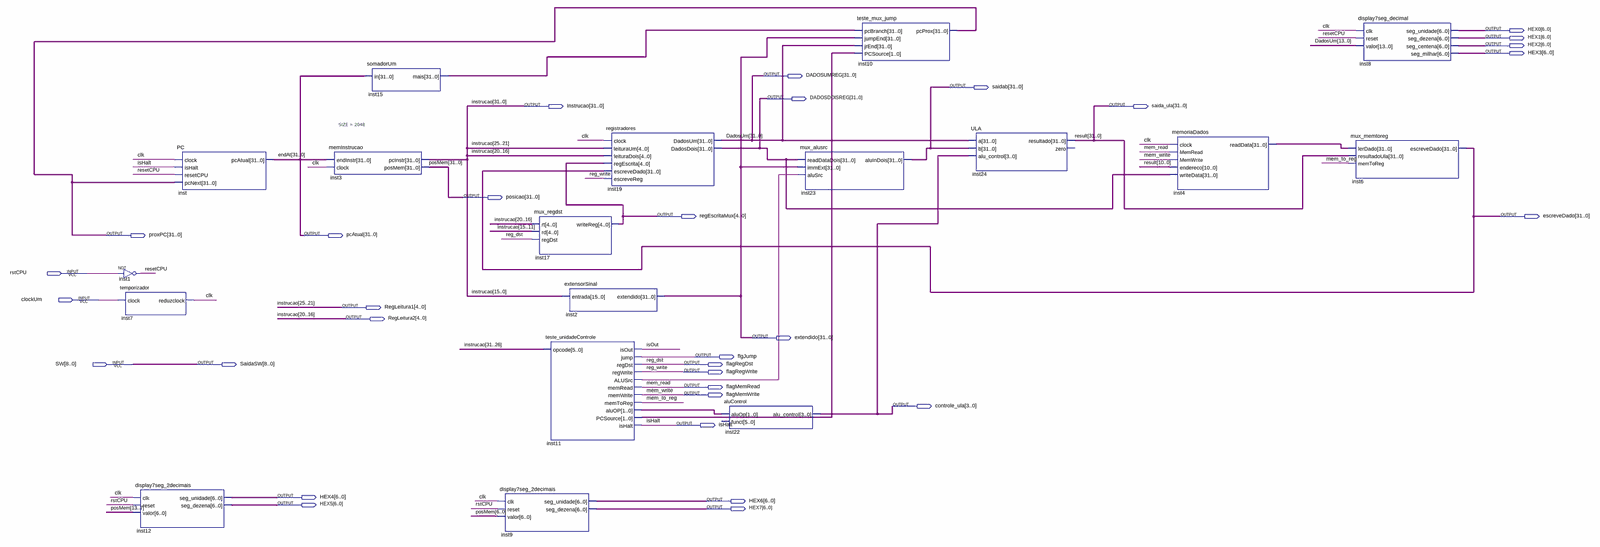
[diagram p0: schematic sheet, whole]
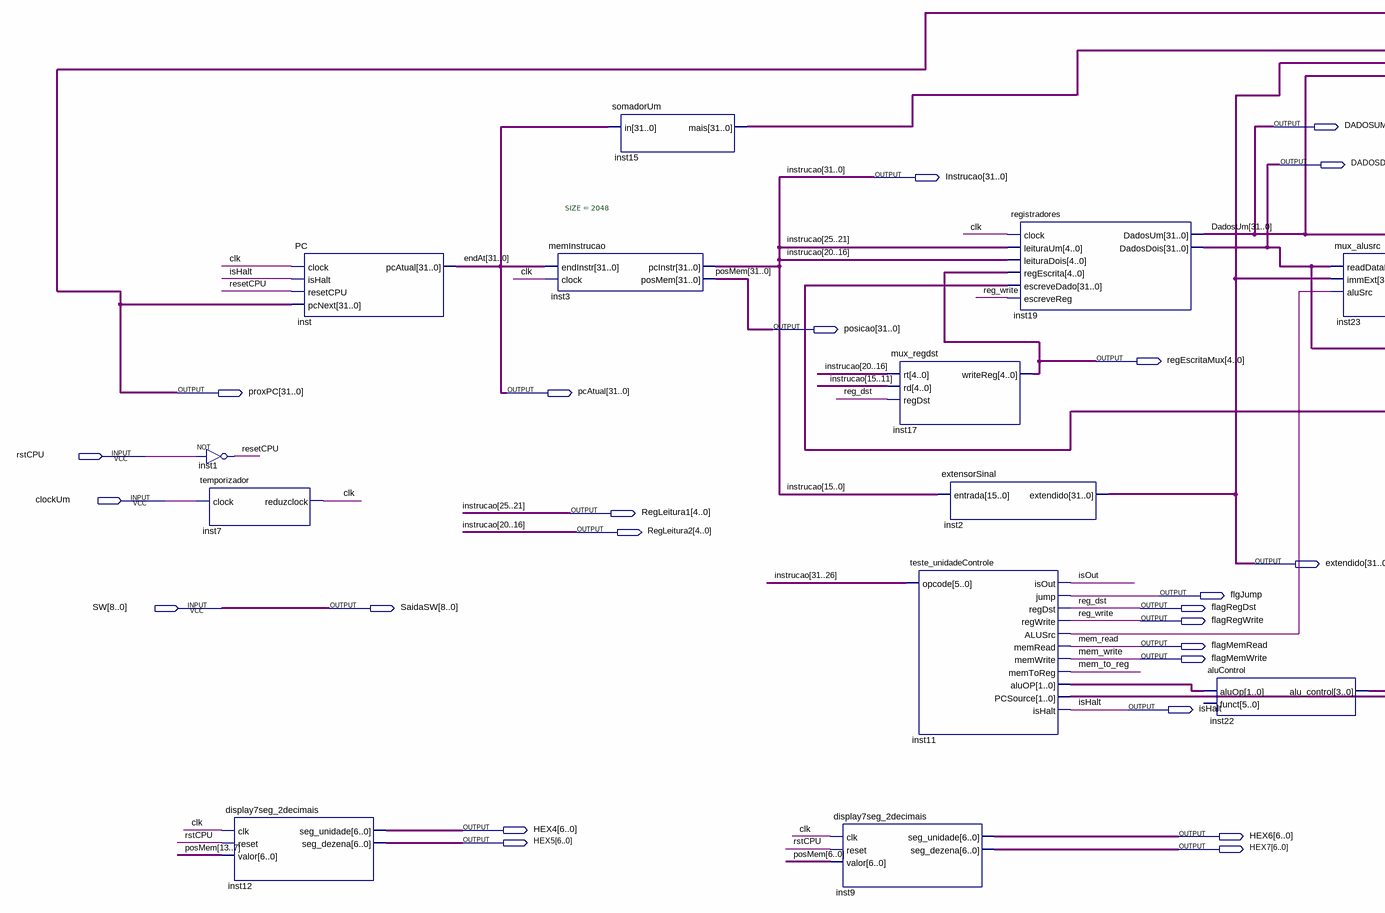
[diagram p1: schematic sheet, left part]
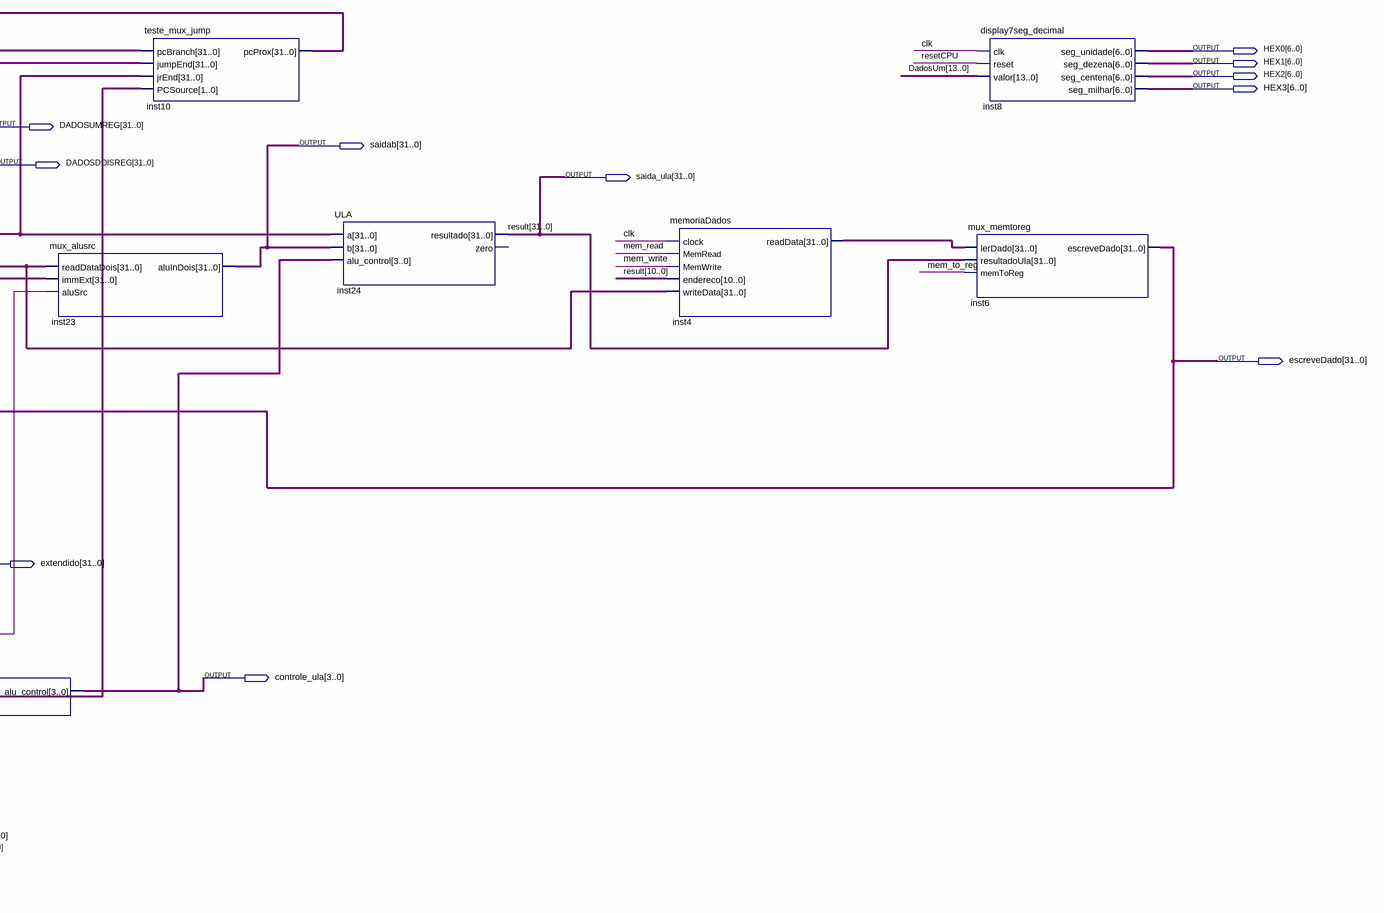
[diagram p2: schematic sheet, right part]
// Quartus schematic testeComponentes.bdf as structural Verilog: 18 symbols, 32 pins
module testeComponentes (
  input  rstCPU,
  input  clockUm,
  input  [8:0] SW,
  output [6:0] HEX0,
  output [6:0] HEX1,
  output [6:0] HEX2,
  output [6:0] HEX3,
  output [31:0] DADOSUMREG,
  output [31:0] saidab,
  output [31:0] DADOSDOISREG,
  output [31:0] Instrucao,
  output [31:0] saida_ula,
  output [31:0] posicao,
  output [4:0] regEscritaMux,
  output [31:0] escreveDado,
  output [31:0] proxPC,
  output [31:0] pcAtual,
  output [4:0] RegLeitura1,
  output [4:0] RegLeitura2,
  output [31:0] extendido,
  output flgJump,
  output [8:0] SaidaSW,
  output flagRegDst,
  output flagRegWrite,
  output flagMemRead,
  output flagMemWrite,
  output [3:0] controle_ula,
  output isHalt,
  output [6:0] HEX4,
  output [6:0] HEX6,
  output [6:0] HEX5,
  output [6:0] HEX7
);

  wire clk, inst11_alusrc, isOut, mem_to_reg, resetCPU;
  wire [1:0] inst11_aluop, inst11_pcsource;
  wire [31:0] inst4_readdata, inst15_mais;

  not inst1 (resetCPU, rstCPU);
  temporizador inst7 (.clock(clockUm), .reduzclock(clk));
  display7seg_2decimais inst12 (
    .clk(clk), .reset(rstCPU), .valor(posicao[13:7]), .seg_unidade(HEX4), .seg_dezena(HEX5));
  PC inst (.clock(clk), .isHalt(isHalt), .resetCPU(resetCPU), .pcNext(proxPC), .pcAtual(pcAtual));
  memInstrucao #(.SIZE(2048)) inst3 (.endInstr(pcAtual), .clock(clk), .pcInstr(Instrucao), .posMem(posicao));
  somadorUm inst15 (.in(pcAtual), .mais(inst15_mais));
  display7seg_2decimais inst9 (.clk(clk), .reset(rstCPU), .valor(posicao[6:0]), .seg_unidade(HEX6), .seg_dezena(HEX7));
  mux_regdst inst17 (.rt(Instrucao[20:16]), .rd(Instrucao[15:11]), .regDst(flagRegDst), .writeReg(regEscritaMux));
  extensorSinal inst2 (.entrada(Instrucao[15:0]), .extendido(extendido));
  teste_unidadeControle inst11 (
    .opcode(Instrucao[31:26]), .isOut(isOut), .jump(flgJump), .regDst(flagRegDst), .regWrite(flagRegWrite),
    .ALUSrc(inst11_alusrc), .memRead(flagMemRead), .memWrite(flagMemWrite), .memToReg(mem_to_reg),
    .aluOP(inst11_aluop), .PCSource(inst11_pcsource), .isHalt(isHalt));
  registradores inst19 (
    .clock(clk), .leituraUm(Instrucao[25:21]), .leituraDois(Instrucao[20:16]), .regEscrita(regEscritaMux),
    .escreveDado(escreveDado), .escreveReg(flagRegWrite), .DadosUm(DADOSUMREG), .DadosDois(DADOSDOISREG));
  aluControl inst22 (.aluOp(inst11_aluop), .alu_control(controle_ula));  // open: funct
  mux_alusrc inst23 (.readDataDois(DADOSDOISREG), .immExt(extendido), .aluSrc(inst11_alusrc), .aluInDois(saidab));
  teste_mux_jump inst10 (
    .pcBranch(inst15_mais), .jumpEnd(extendido), .jrEnd(DADOSUMREG), .PCSource(inst11_pcsource),
    .pcProx(proxPC));
  ULA inst24 (.a(DADOSUMREG), .b(saidab), .alu_control(controle_ula), .resultado(saida_ula));  // open: zero
  memoriaDados inst4 (
    .clock(clk), .MemRead(flagMemRead), .MemWrite(flagMemWrite), .endereco(saida_ula[10:0]),
    .writeData(DADOSDOISREG), .readData(inst4_readdata));
  display7seg_decimal inst8 (
    .clk(clk), .reset(resetCPU), .valor(DADOSUMREG[13:0]), .seg_unidade(HEX0), .seg_dezena(HEX1),
    .seg_centena(HEX2), .seg_milhar(HEX3));
  mux_memtoreg inst6 (
    .lerDado(inst4_readdata), .resultadoUla(saida_ula), .memToReg(mem_to_reg), .escreveDado(escreveDado));

  assign RegLeitura1 = Instrucao[25:21];
  assign RegLeitura2 = Instrucao[20:16];
  assign SaidaSW = SW;

  // Other names for the same wires on the sheet: DadosUm[31:0] = DADOSUMREG; mem_read = flagMemRead;
  //   mem_write = flagMemWrite; endAt[31:0] = pcAtual; posMem[31:0] = posicao; reg_dst = flagRegDst;
  //   reg_write = flagRegWrite; result[31:0] = saida_ula
endmodule
